# EAGLE design Modul (EAGLE 6.4)
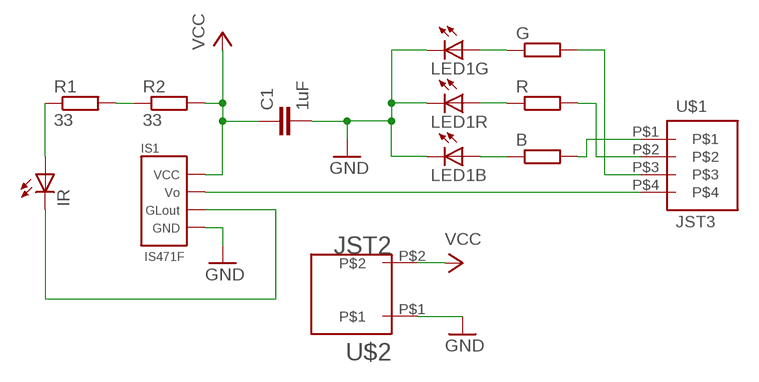
[diagram p0: schematic, sheet 1]

## Parts
B  R-EU_R1206  [R1206]
C1  1uF  C-EUC1206  [C1206]
G  R-EU_R1206  [R1206]
IR  LEDSML1206  [SML1206]
IS1  IS471F  [IS471F]
LED1  LP2C63-ST-RGB-SR0  [LP2C63-ST-RGB-SR0]
R  R-EU_R1206  [R1206]
R1  33  R-EU_R1206  [R1206]
R2  33  R-EU_R1206  [R1206]
U$1  JST3  [JST]
U$2  JST2  [JST]

## Nets
GND: C1.2 IS1.P$3(GND) LED1.4(B:C) LED1.5(R:C) LED1.6(G:C) U$2.P$1
N$1: R1.2 R2.1
N$2: IR.A R1.1
N$3: IR.C IS1.P$4(GL)
N$4: IS1.P$2(VO) U$1.P$4
N$5: G.1 LED1.1(G:A)
N$6: R.2 U$1.P$2
N$7: B.2 U$1.P$1
N$8: G.2 U$1.P$3
N$9: LED1.2(R:A) R.1
N$10: B.1 LED1.3(B:A)
VCC: C1.1 IS1.P$1(VCC) R2.2 U$2.P$2
Unconnected: LED1.TH(TH:TH)

## Library data of the parts
B G R R1 R2 = rcl:R-EU_: RESISTOR, European symbol
C1 = rcl:C-EU: CAPACITOR, European symbol
IR = led:LED: LED OSRAM: - CHIPLED LG R971, LG N971, LY N971, LG Q971, LY Q971, LO R971, LY R971 LH N974, LH R974 LS Q976, LO Q976, LY Q976 LO Q996 - Hyper CHIPLED LW Q18S LB Q993, LB Q99A, LB R99A - SideLED LS A670, LO A670, LY A670, LG A670, LP A670 LB A673, LV A673, LT A673, LW A673 LH A674 LY A675 LS A676, LA A676, LO A676, LY A676, LW A676 LS A679, LY A679, LG A679 - Hyper Micro SIDELED® LS Y876, LA Y876, LO Y876, LY Y876 LT Y87S - SmartLED LW L88C, LW L88S LB L89C, LB L89S, LG L890 LS L89K, LO L89K, LY L89K LS L896, LA L896, LO L896, LY L896 - TOPLED LS T670, LO T670, LY T670, LG T670, LP T670 LSG T670, LSP T670, LSY T670, LOP T670, LYG T670 LG T671, LOG T671, LSG T671 LB T673, LV T673, LT T673, LW T673 LH T674 LS T676, LA T676, LO T676, LY T676, LB T676, LH T676, LSB T676, LW T676 LB T67C, LV T67C, LT T67C, LS T67K, LO T67K, LY T67K, LW E67C LS E67B, LA E67B, LO E67B, LY E67B, LB E67C, LV E67C, LT E67C LW T67C LS T679, LY T679, LG T679 LS T770, LO T770, LY T770, LG T770, LP T770 LB T773, LV T773, LT T773, LW T773 LH T774 LS E675, LA E675, LY E675, LS T675 LS T776, LA T776, LO T776, LY T776, LB T776 LHGB T686 LT T68C, LB T68C - Hyper Mini TOPLED® LB M676 - Mini TOPLED Santana® LG M470 LS M47K, LO M47K, LY M47K Source: http://www.osram.convergy.de LUXEON: - LUMILED® LXK2-PW12-R00, LXK2-PW12-S00, LXK2-PW14-U00, LXK2-PW14-V00 LXK2-PM12-R00, LXK2-PM12-S00, LXK2-PM14-U00 LXK2-PE12-Q00, LXK2-PE12-R00, LXK2-PE12-S00, LXK2-PE14-T00, LXK2-PE14-U00 LXK2-PB12-K00, LXK2-PB12-L00, LXK2-PB12-M00, LXK2-PB14-N00, LXK2-PB14-P00, LXK2-PB14-Q00 LXK2-PR12-L00, LXK2-PR12-M00, LXK2-PR14-Q00, LXK2-PR14-R00 LXK2-PD12-Q00, LXK2-PD12-R00, LXK2-PD12-S00 LXK2-PH12-R00, LXK2-PH12-S00 LXK2-PL12-P00, LXK2-PL12-Q00, LXK2-PL12-R00 Source: www.luxeon.com KINGBRIGHT: KA-3528ASYC Source: www.kingbright.com
IS1 = is471f:IS471F: IS471F, Détecteur infrarouge de SHARP
LED1 = led:LP2C63-ST-RGB-SR0: 1.5W RGB HIGH POWER LED Source: http://www.ledtech.com.tw .. LP2C63-ST-RGB-SR0.SPEC.pdf
U$1 = JST3-2AMP:JST3
U$2 = JST-2:JST2

## Board
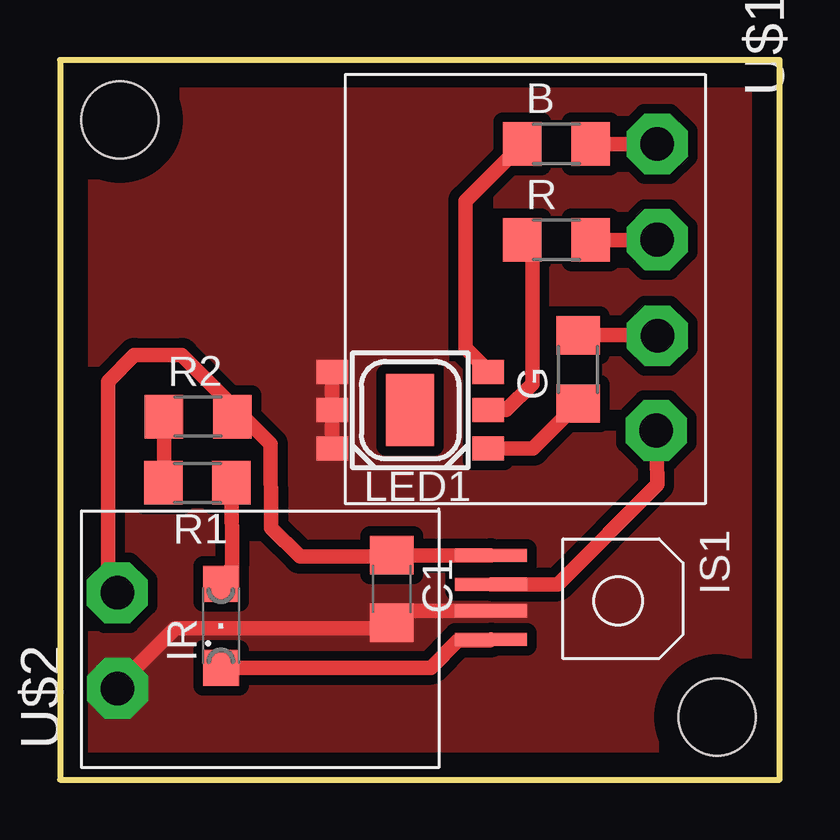
[diagram p1: board, top side]

Size 30 x 30 mm. Coordinates in mm from the lower left corner, seen from the top.
Outline: 0,0 30,0 30,30 0,30 0,0
Copper layers (1*16): Top 0.035mm / dielectric 1.5mm / Bottom 0.035mm
Design rules "default": minimum track width 10mil, minimum drill 24mil, track to track 8mil, track to pad 8mil, pad to pad 8mil, via to via 8mil, smd to smd 8mil, copper to edge 40mil, drill to drill 8mil, minimum pad ring 10mil, minimum via ring 8mil, stop-mask expansion 4mil, vias tented up to drill 0mil, thermal gap 10mil
Holes 3.2 mm at 2.5,27.5 27.4,2.6

### Footprints (pad centres in the part's own frame; a part is rotated, then mirrored left to right if it is on the bottom)
R1206 = smd 1.6 x 1.803: 1 -1.422,0; 2 1.422,0
C1206 = smd 1.6 x 1.8: 1 -1.4,0; 2 1.4,0
SML1206 = smd 1.5 x 1.5: A 1.75,0; C -1.75,0
IS471F = smd 0.55 x 3: P$1 -2.3,-4; P$2 -1.1,-4; P$3 0,-4; P$4 1.2,-4
LP2C63-ST-RGB-SR0 = smd 1.3 x 1: 1 -3.25,1.6; 2 -3.25,0; 3 -3.25,-1.6; 4 3.25,-1.6; 5 3.25,0; 6 3.25,1.6 | smd 2 x 3: TH 0,0
JST = drill 1.4 pad 2.54 octagon: P$1 0,4; P$2 3.99,4; P$3 8,4.01; P$4 11.95,3.96
JST' = drill 1.4 pad 2.54 octagon: P$1 0,6.5; P$2 3.99,6.51

### Placement (x,y rotation side)
B  20.7,26.5 0 top
C1  13.83,7.95 270 top
G  21.6,17.1 90 top
IR  6.71,6.41 90 top
IS1  21.97,7.04 270 top
LED1  14.6,15.4 180 top
R  20.7,22.5 0 top
R1  5.73,12.37 180 top
R2  5.76,15.13 0 top
U$1  20.9,26.5 270 top
U$2  JST2  [JST']  8.9,3.8 90 top

### Tracks (layer width: path | path; a pad name or v marks a point on that pad's centre or on a via)
GND
  Top 0.61: LED1.6 LED1.5 LED1.4 | IS1.P$3 14.32,7.04 C1.2 13.58,6.3 4.8,6.3 2.4,3.9 U$2.P$1
  pour Top (isolate 0.406, no thermals): -0.5,30.4 -0.7,-0.9 -0.7,-1.7 30.4,-1.7 30.4,31.5 -0.7,31.5
N$1
  Top 0.61: R2.1 4.34,12.4 R1.2
N$2
  Top 0.61: R1.1 7.17,8.9 IR.A
N$3
  Top 0.61: IR.C 15.46,4.66 16.6,5.8 17.93,5.8 IS1.P$4
N$4
  Top 0.61: IS1.P$2 20.75,8.14 24.9,12.3 U$1.P$4
N$5
  Top 0.61: LED1.1 19.72,13.8 G.1
N$6
  Top 0.61: R.2 U$1.P$2
N$7
  Top 0.61: B.2 U$1.P$1
N$8
  Top 0.61: G.2 24.89,18.52 U$1.P$3
N$9
  Top 0.61: LED1.2 18.6,15.4 19.7,16.5 19.7,22.32 R.1
N$10
  Top 0.61: LED1.3 17.85,17.05 16.9,18 16.9,24.12 B.1
VCC
  Top 0.61: C1.1 14.5,9.35 | 14.5,9.35 IS1.P$1 | R2.2 7.74,15.04 | 7.74,15.04 8.78,13.98 8.8,10.5 10,9.3 14.45,9.3 14.5,9.35 | U$2.P$2 2.39,8.11 2,8.5 2,16.6 3.1,17.7 5.08,17.7 7.74,15.04